# Altium schematic sheet HF_AMP.SchDoc: HF RF AMP
size A4; DocumentNumber: 17; Revision: 2.0; SheetNumber: 17; SheetTotal: 18
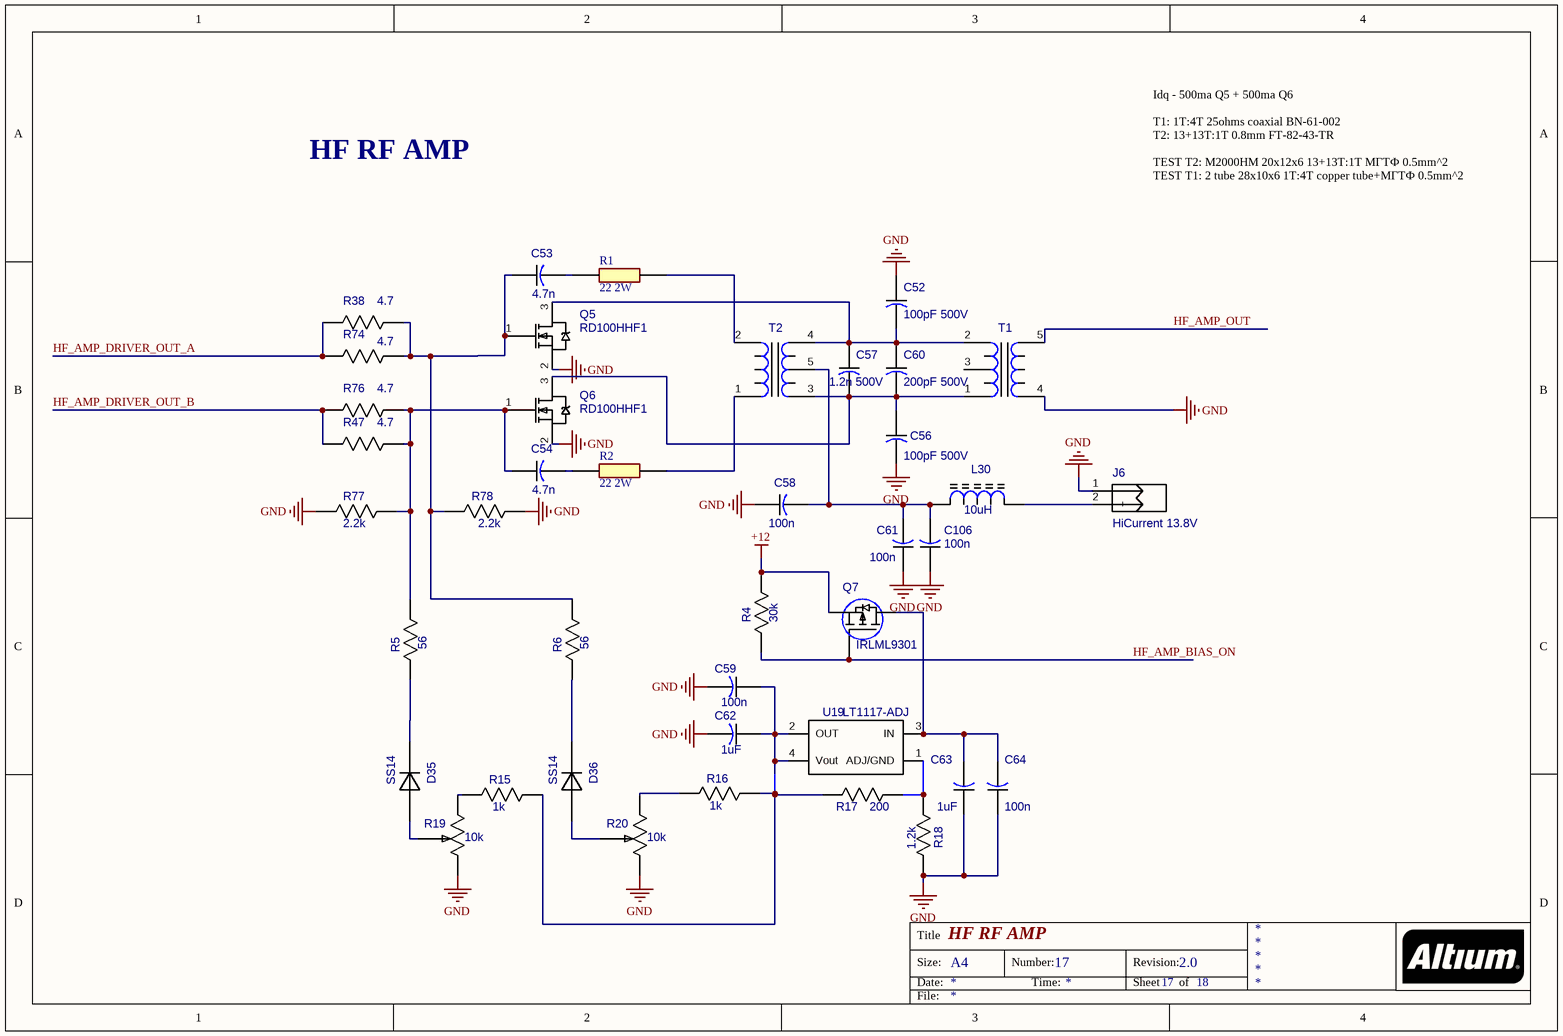
[diagram p0: HF_AMP.SchDoc]

## Parts
C52  100pF 500V  [CAP_1206]
C53  4.7n  [CAP_1206]
C54  4.7n  [CAP_1206]
C56  100pF 500V  [CAP_1206]
C57  1.2n 500V  [CAP_1206]
C58  100n  [CAP_1206]
C59  100n  [CAP_0805]
C60  200pF 500V  [CAP_1206]
C61  100n  [CAP_1206]
C62  1uF  [CAP_0805]
C63  1uF  [CAP_0805]
C64  100n  [CAP_0805]
C106  100n  [CAP_1206]
D35  SS14  [SS14]
D36  SS14  [SS14]
J6  HiCurrent 13.8V  [1986717-2]
L30  10uH  [IND_FERRITE_CORE]
Q5  RD100HHF1  [RD100_V2]
Q6  RD100HHF1  [RD100_V2]
Q7  IRLML9301  [SOT23]
R1  22 2W  [RES-2W]
R2  22 2W  [RES-2W]
R4  30k  [RES_0805]
R5  56  [RES_0805]
R6  56  [RES_0805]
R15  1k  [RES_0805]
R16  1k  [RES_0805]
R17  200  [RES_0805]
R18  1.2k  [RES_0805]
R19  value 10k  [306J]  (hidden comment: ADJ-10k)
R20  value 10k  [306J]  (hidden comment: ADJ-10k)
R38  4.7  [RES_1206]
R47  4.7  [RES_1206]
R74  4.7  [RES_1206]
R76  4.7  [RES_1206]
R77  2.2k  [RES_0805]
R78  2.2k  [RES_0805]
T1  TRANSF_HF2  [TRANSF_HF2-3]  (value not drawn)
T2  TRANSF_HF1  [TRANSF_HF1]  (value not drawn)
U19  value LT1117-ADJ  [LT1117IST-ADJ]  (hidden comment: LT1117IST-ADJ)

## Nets
+12: Q7.2(S) R4.2
GND: C52.1 C56.2 C58.1 C59.2 C61.1 C62.2 C63.1 C64.1 C106.1 J6.1(-) Q5.2(S) Q6.2(S) R18.2 R19.1(CCW) R20.1(CCW) R77.1 R78.2 T1.4(S1)
HF_AMP_BIAS_ON: Q7.1(G) R4.1
HF_AMP_DRIVER_OUT_A: R38.1 R74.1
HF_AMP_DRIVER_OUT_B: R47.1 R76.1
HF_AMP_OUT: T1.5(S2)
NetC52_2: C52.2 C57.1 C60.1 Q5.3(D) T1.2(P2) T2.4(S2)
NetC53_1: C53.1 Q5.1(G) R6.2 R38.2 R74.2 R78.1
NetC53_2: C53.2 R1.1
NetC54_1: C54.1 Q6.1(G) R5.2 R47.2 R76.2 R77.2
NetC54_2: C54.2 R2.1
NetC56_1: C56.1 C57.2 C60.2 Q6.3(D) T1.1(P1) T2.3(S1)
NetC58_2: C58.2 C61.2 C106.2 L30.1(A) T2.5(S3)
NetC59_1: C59.1 C62.1 R15.2 R16.2 R17.1 U19.2(OUT) U19.4(Vout)
NetC63_2: C63.2 C64.2 Q7.3(D) U19.3(IN)
NetD35_1: D35.1(K) R5.1
NetD35_2: D35.2(A) R19.2(W)
NetD36_1: D36.1(K) R6.1
NetD36_2: D36.2(A) R20.2(W)
NetJ6_2: J6.2(+) L30.2(B)
NetR1_2: R1.2 T2.2(P2)
NetR2_2: R2.2 T2.1(P1)
NetR15_1: R15.1 R19.3(CW)
NetR16_1: R16.1 R20.3(CW)
NetR17_2: R17.2 R18.1 U19.1(ADJ/GND)

Not connected (* = marked no-connect by the designer): T1 3(P3)

## Notes on the sheet
- HF RF AMP
- Idq - 500ma Q5 + 500ma Q6
  T1: 1T:4T 25ohms coaxial BN-61-002
  T2: 13+13T:1T 0.8mm FT-82-43-TR
  TEST T2: M2000HM 20x12x6 13+13T:1T МГТФ 0.5mm^2
  TEST T1: 2 tube 28x10x6 1T:4T copper tube+МГТФ 0.5mm^2
- Title
- Size:
- Date:
- A4
- Number:
- Time:
- Revision:
- Sheet
- of
- File:

## Library data of the parts
C52-C54 C56-C58 C60 C61 C106 = CAP_1206
C59 C62-C64 = CAP_0805
  C59 C64: Value: 100n
  C62 C63: Value: 1uF
J6 = 1986717-2: JX2
L30 = IND_FERRITE_CORE: Inductor; Value: 10uH
Q7 = MOSFET_ENH_PD: MOSFET; Value: IRLML9301
R1 R2 = CFR200J100R: Manufacturer_Name: TE Connectivity; Datasheet Link: http://www.te.com/commerce/DocumentDelivery/DDEController?Action=showdoc&DocId=Data+Sheet%7F1773195%7FE%7Fpdf%7FEnglish%7FENG_DS_1773195_E.pdf%7F1623929-2; Manufacturer_Part_Number: CFR200J100R; Mouser Part Number: 279-CFR200J100R; Mouser Price/Stock: https://www.mouser.com/Search/Refine.aspx?Keyword=279-CFR200J100R; Arrow Part Number: CFR200J100R; Arrow Price/Stock: https://www.arrow.com/en/products/cfr200j100r/te-connectivity
R4-R6 R15-R18 R77 R78 = RES_0805
  R4: Value: 30k
  R5 R6: Value: 56
  R15 R16: Value: 1k
  R17: Value: 200
  R18: Value: 1.2k
R19 R20 = 306J
R38 R47 R74 R76 = RES_1206
T1 = TRANSF_RF2: Value: *
T2 = TRANSF_RF1: Value: *
D35 D36 = SS14: Value: SS14
Q5 Q6 = RD100HHF1: Value: RD100HHF1